# Altium schematic sheet levelTranslate.SchDoc
size 127 x 76 mm
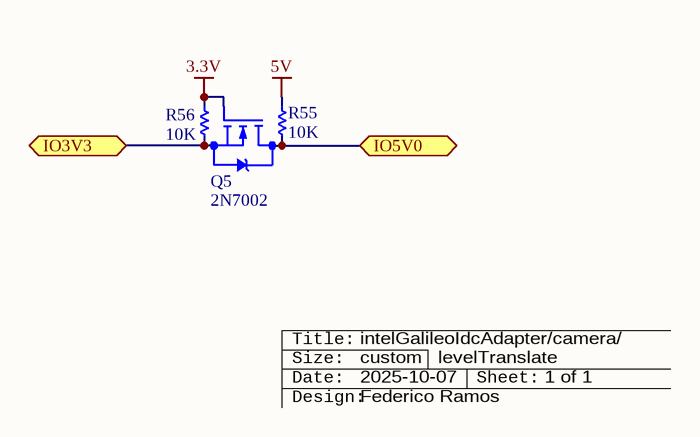
[diagram p0: levelTranslate.SchDoc]

## Parts
Q5  2N7002  [SOT23]
R55  value 10K  [R1206]  (hidden comment: Res)
R56  value 10K  [R1206]  (hidden comment: Res)
ROT?  Rotulo_empty_longTitle  (value not drawn)  (graphical)

## Ports
IO3V3 (bidir), IO5V0 (bidir)

## Nets
3.3V: Q5.1(G) R56.2
5V: R55.2
IO3V3: Q5.3(S) R56.1 ; port IO3V3
IO5V0: Q5.2(D) R55.1 ; port IO5V0

## Notes on the sheet
- (near ROT?) intelGalileoIdcAdapter/camera/
- custom
- 2025-10-07
- levelTranslate
- (near ROT?) 1 of 1
- Federico Ramos
- (in symbol Rotulo_empty_longTitle) Title:; Size:; Date:; Sheet:; Design:

## Library data of the parts
Q5 = 2N7002: N-Channel MOSFET 60V  0.1A 7.5 ohm; pin to pad: 2>3 3>2; Price: ?
R55 R56 = Res: Resistencia; Power: 0.25W; Price: 0.036
ROT? = Rotulo_empty_longTitle: Rotulo [consolas]